# EAGLE design Beepoo (EAGLE 6.5.0)
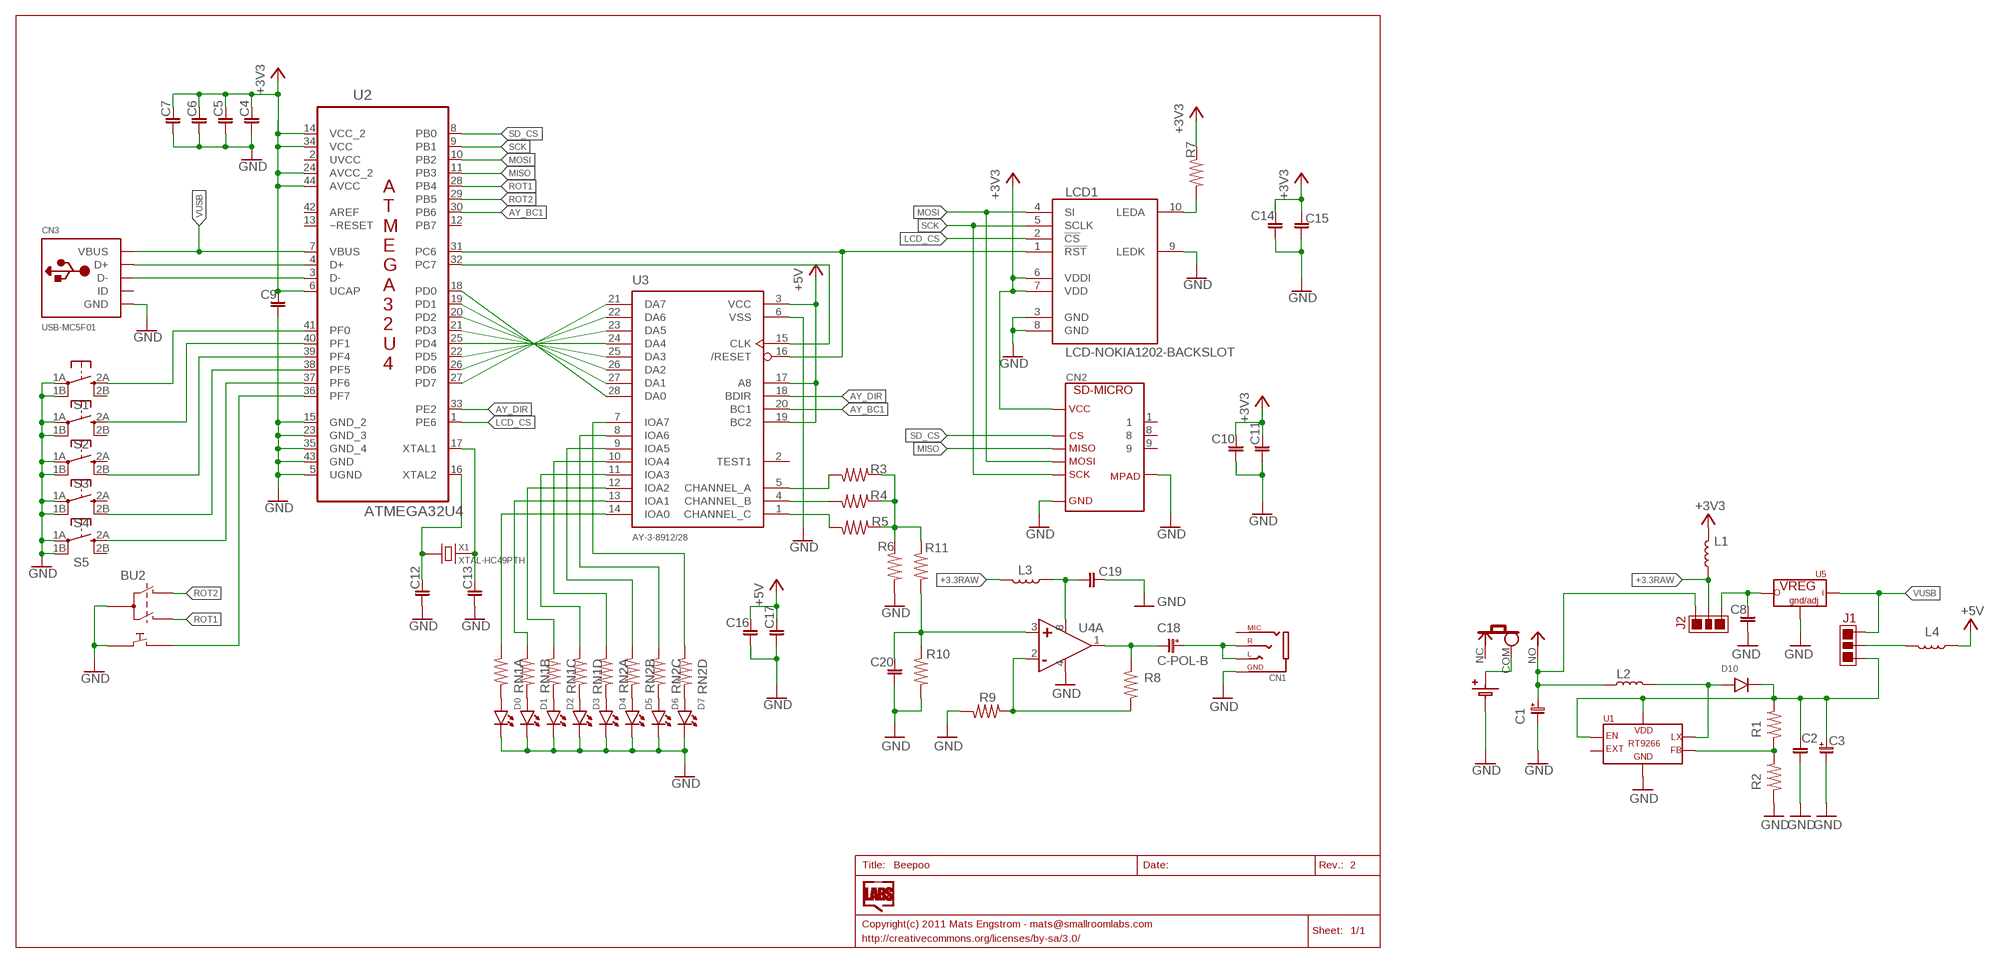
[diagram p0: schematic, sheet 1]

## Parts
BA1  BATTERY2-CR123  [BAT-CR123A]
BU2  ROTARY  [ROTARY]
C1  C-POL-C  [PANASONIC_C]
C2  C-0805  [C0805]
C3  EEEFK0J101UR  C-POL-C  [PANASONIC_C]
C4  C-0805  [C0805]
C5  C-0805  [C0805]
C6  C-0805  [C0805]
C7  C-0805  [C0805]
C8  1u  C-0805  [C0805]
C9  1u  C-0805  [C0805]
C10  1u  C-0805  [C0805]
C11  C-0805  [C0805]
C12  C-0805  [C0805]
C13  C-0805  [C0805]
C14  1u  C-0805  [C0805]
C15  C-0805  [C0805]
C16  1u  C-0805  [C0805]
C17  C-0805  [C0805]
C18  C-POL-B  [PANASONIC_B]
C19  1u  C-0805  [C0805]
C20  C-0805  [C0805]
CN1  JACK4PTH  [PJ320E]
CN2  SD-MICRO  [SD-TFP09]
CN3  USB-MC5F01  [USB-MICRO-MC5F01]
D0  LED-0805  [LED0805]
D1  LED-0805  [LED0805]
D2  LED-0805  [LED0805]
D3  LED-0805  [LED0805]
D4  LED-0805  [LED0805]
D5  LED-0805  [LED0805]
D6  LED-0805  [LED0805]
D7  LED-0805  [LED0805]
D10  DIODE-SOD123  [SOD123]
J1  JUMPER3-1.5MM  [JP3-1.5MM]
J2  JUMPER3-1.5MM  [JP3-1.5MM]
L1  L-0805  [L0805]
L2  L-BOURNS-SRP7030  [IND-BOURNS-SRP7030]
L3  L-0805  [L0805]
L4  L-0805  [L0805]
LCD1  LCD-NOKIA1202-BACKSLOT  [NOKIA1202LCD-BACK-SLOT]
R1  R-0805  [R0805]
R2  R-0805  [R0805]
R3  R-0805  [R0805]
R4  R-0805  [R0805]
R5  R-0805  [R0805]
R6  R-0805  [R0805]
R7  R-0805  [R0805]
R8  R-0805  [R0805]
R9  R-0805  [R0805]
R10  R-0805  [R0805]
R11  R-0805  [R0805]
RN1  R-ARR4  [RN8P-4R-CRA06S]
RN2  R-ARR4  [RN8P-4R-CRA06S]
S1  SWITCH2-12X12PTH  [TACT12X12-PTH]
S2  SWITCH2-12X12PTH  [TACT12X12-PTH]
S3  SWITCH2-12X12PTH  [TACT12X12-PTH]
S4  SWITCH2-12X12PTH  [TACT12X12-PTH]
S5  SWITCH2-12X12PTH  [TACT12X12-PTH]
SW2  SLIDE1-PCM12  [SW-PCM12]
U1  RT9266-SOT23  [SOT23-6]
U2  ATMEGA32U4  [TQFP44]
U3  AY-3-8912/28  [DIL28-6]
U4  OPAMP-DUAL-SOIC8  [SO08]
U5  VREG3-SOT223  [SOT223]
X1  XTAL-HC49PTH  [HC49US]

## Nets
+3.3RAW: J2.P$2 L1.1 L3.2
+3V3: C4.2 C5.2 C6.2 C7.2 C9.2 C10.2 C11.2 C14.2 C15.2 CN2.4 L1.2 LCD1.6(VDDI) LCD1.7(VDD) R7.1 U2.6(UCAP) U2.14(VCC_2) U2.24(AVCC_2) U2.34(VCC) U2.44(AVCC)
+5V: C16.2 C17.2 L4.1 U3.3(VCC) U3.17(A8) U3.19(BC2)
AY_BC1: U2.30(PB6) U3.20(BC1)
AY_CLK: U2.32(PC7) U3.15(CLK)
AY_DIR: U2.33(PE2) U3.18(BDIR)
AY_RESET: LCD1.1(!RST) U2.31(PC6) U3.16(/RESET)
BAT: BA1.POS(POS1) SW2.COM
BAT-SWITCHED: C1.+(A) J2.P$1 L2.P$1 SW2.NO
GND: BA1.NEG BU2.Q BU2.SW1 C1.-(C) C2.2 C3.-(C) C4.1 C5.1 C6.1 C7.1 C8.1 C9.1 C10.1 C11.1 C12.1 C13.1 C14.1 C15.1 C16.1 C17.1 C19.2 C20.1 CN1.G(GND) CN2.GND@1 CN2.GND@2 CN3.P5(GND) D0.C D1.C D2.C D3.C D4.C D5.C D6.C D7.C LCD1.3(GND) LCD1.8(GND) LCD1.9(LEDK) R2.1 R6.2 R9.2 R10.2 S1.1A S1.1B S2.1A S2.1B S3.1A S3.1B S4.1A S4.1B S5.1A S5.1B U1.3(GND) U2.5(UGND) U2.15(GND_2) U2.23(GND_3) U2.35(GND_4) U2.43(GND) U3.6(VSS) U4.4(A:V-) U5.1(G/A)
LCD_CS: LCD1.2(!CS) U2.1(PE6)
MISO: CN2.7 U2.11(PB3)
MOSI: CN2.3 LCD1.4(SI) U2.10(PB2)
N$1: D10.A L2.P$2 U1.4(LX)
N$2: C18.+(A) CN1.L CN1.R
N$3: R1.1 R2.2 U1.6(FB)
N$4: U2.27(PD7) U3.21(DA7)
N$5: U2.26(PD6) U3.22(DA6)
N$6: U2.22(PD5) U3.23(DA5)
N$7: U2.25(PD4) U3.24(DA4)
N$8: U2.21(PD3) U3.25(DA3)
N$9: U2.20(PD2) U3.26(DA2)
N$10: U2.19(PD1) U3.27(DA1)
N$11: U2.18(PD0) U3.28(DA0)
N$12: C8.2 J2.P$3 U5.2(OUT) U5.4(OUT)
N$13: CN3.P3(D+) U2.4(D+)
N$14: CN3.P2(D-) U2.3(D-)
N$15: C2.1 C3.+(A) D10.C J1.P$3 R1.2 U1.1(EN) U1.5(VDD)
N$16: D0.A RN1.8
N$17: D1.A RN1.7
N$18: D2.A RN1.6
N$19: D3.A RN1.5
N$20: D4.A RN2.8
N$21: C12.2 U2.16(XTAL2) X1.1
N$22: D5.A RN2.7
N$23: D7.A RN2.5
N$24: D6.A RN2.6
N$25: RN2.4 U3.7(IOA7)
N$26: RN2.3 U3.8(IOA6)
N$27: RN2.2 U3.9(IOA5)
N$28: RN2.1 U3.10(IOA4)
N$29: RN1.4 U3.11(IOA3)
N$30: RN1.3 U3.12(IOA2)
N$31: RN1.2 U3.13(IOA1)
N$32: RN1.1 U3.14(IOA0)
N$33: R3.2 U3.5(CHANNEL_A)
N$34: R4.2 U3.4(CHANNEL_B)
N$35: R5.2 U3.1(CHANNEL_C)
N$36: S1.2A U2.41(PF0)
N$37: S2.2A U2.40(PF1)
N$38: S3.2B U2.39(PF4)
N$39: S4.2B U2.38(PF5)
N$40: S5.2A U2.37(PF6)
N$41: R3.1 R4.1 R5.1 R6.1 R11.1
N$42: BU2.SW2 U2.36(PF7)
N$43: C13.2 U2.17(XTAL1) X1.2
N$44: LCD1.10(LEDA) R7.2
N$45: C18.-(C) R8.1 U4.1(A:OUT)
N$46: C19.1 L3.1 U4.8(A:V+)
N$47: R8.2 R9.1 U4.2(A:NEG)
N$48: J1.P$2 L4.2
N$49: C20.2 R10.1 R11.2 U4.3(A:POS)
ROT1: BU2.Q2 U2.28(PB4)
ROT2: BU2.Q1 U2.29(PB5)
SCK: CN2.5 LCD1.5(SCLK) U2.9(PB1)
SD_CS: CN2.2 U2.8(PB0)
VUSB: CN3.P1(VBUS) J1.P$1 U2.7(VBUS) U5.3(IN)
Unconnected: CN1.MIC CN2.1 CN2.8 CN2.9 CN3.P4(ID) S1.2B S2.2B S3.2A S4.2A S5.2B SW2.NC U1.2(EXT) U2.12(PB7) U2.13(~RESET) U2.42(AREF) U3.2(TEST1) U4.5(B:POS) U4.6(B:NEG) U4.7(B:OUT)

## Power pins joined to a net without a drawn wire
UVCC: U2.2(UVCC)

## Library data of the parts
BA1 = SRL:BATTERY2
BU2 = SRL:ROTARY
C1 C3 C18 = SRL:C-POL
C2 C4-C17 C19 C20 = SRL:C: Not verified
CN1 = SRL:JACK4
CN2 = SRL:SD
CN3 = SRL:USB
D0 D1-D7 = SRL:LED
D10 = SRL:DIODE
J1 J2 = SRL:JUMPER3
L1-L4 = SRL:L: Not verified
LCD1 = SRL:LCD-NOKIA1202
R1-R11 = SRL:R: Not Verified
RN1 RN2 = SRL:R-ARR4: 4 Resistor Array 0603
S1-S5 = SRL:SWITCH2
SW2 = SRL:SLIDE1
U1 = SRL:RT9266
U2 = SRL:ATMEGA32U4: 8-bit Microcontroller with ISP Flash and USB Controller
U3 = SRL:AY-3-8912/28
U4 = SRL:OPAMP-DUAL
U5 = SRL:VREG3
X1 = SRL:XTAL

## Board
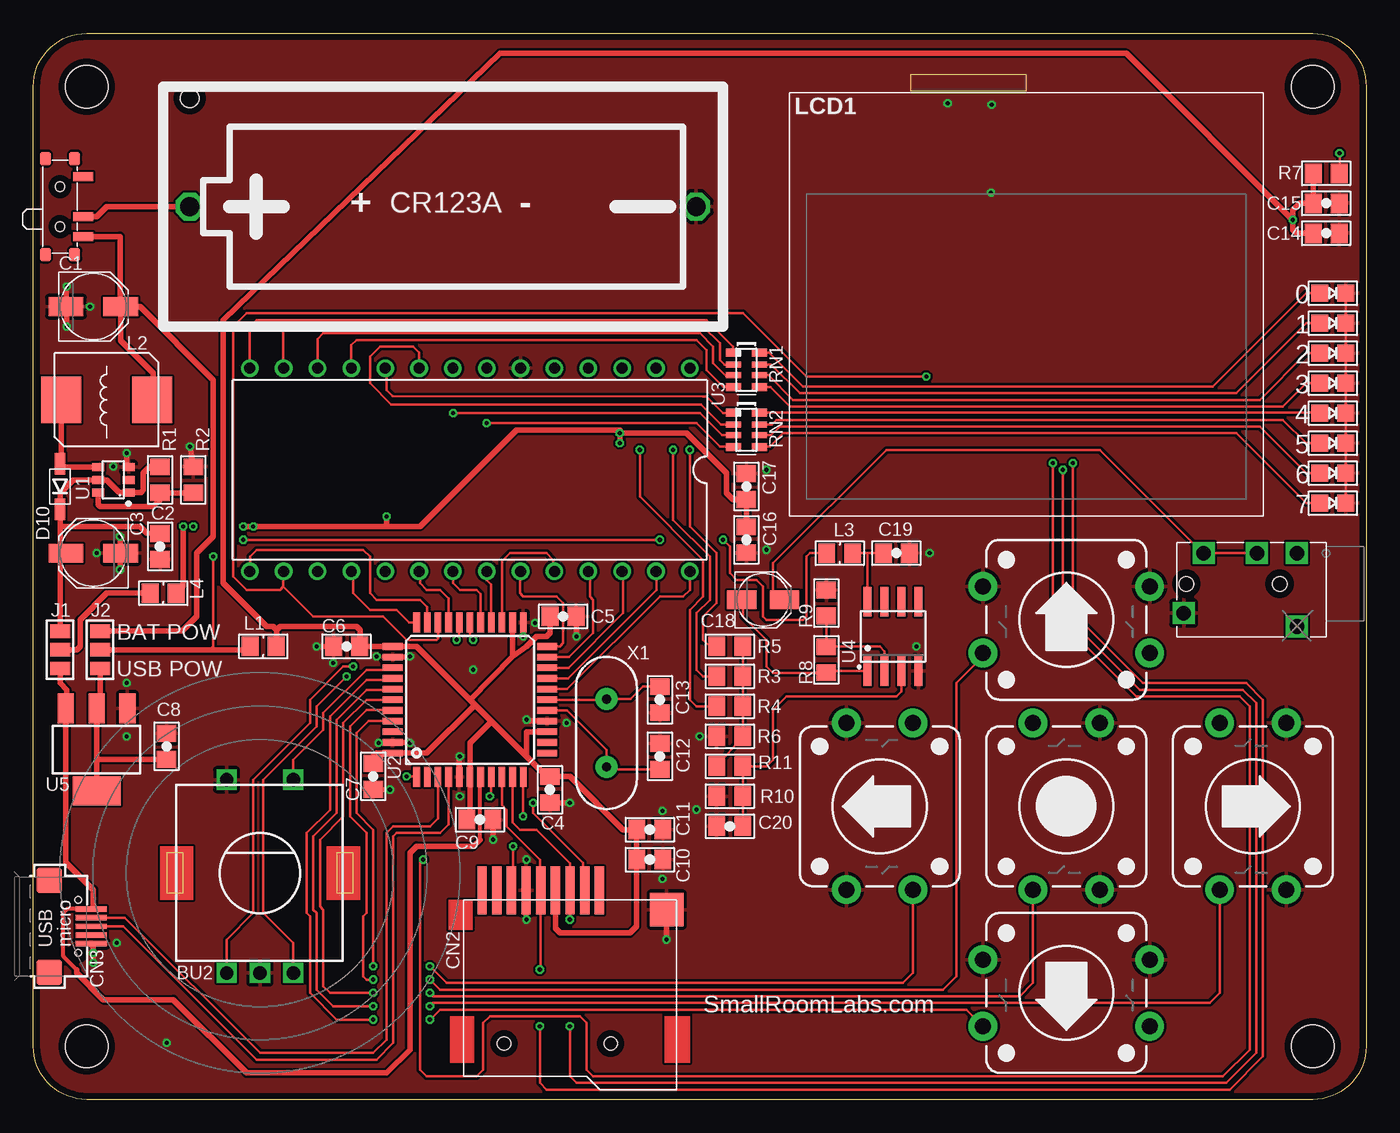
[diagram p1: board, top side]
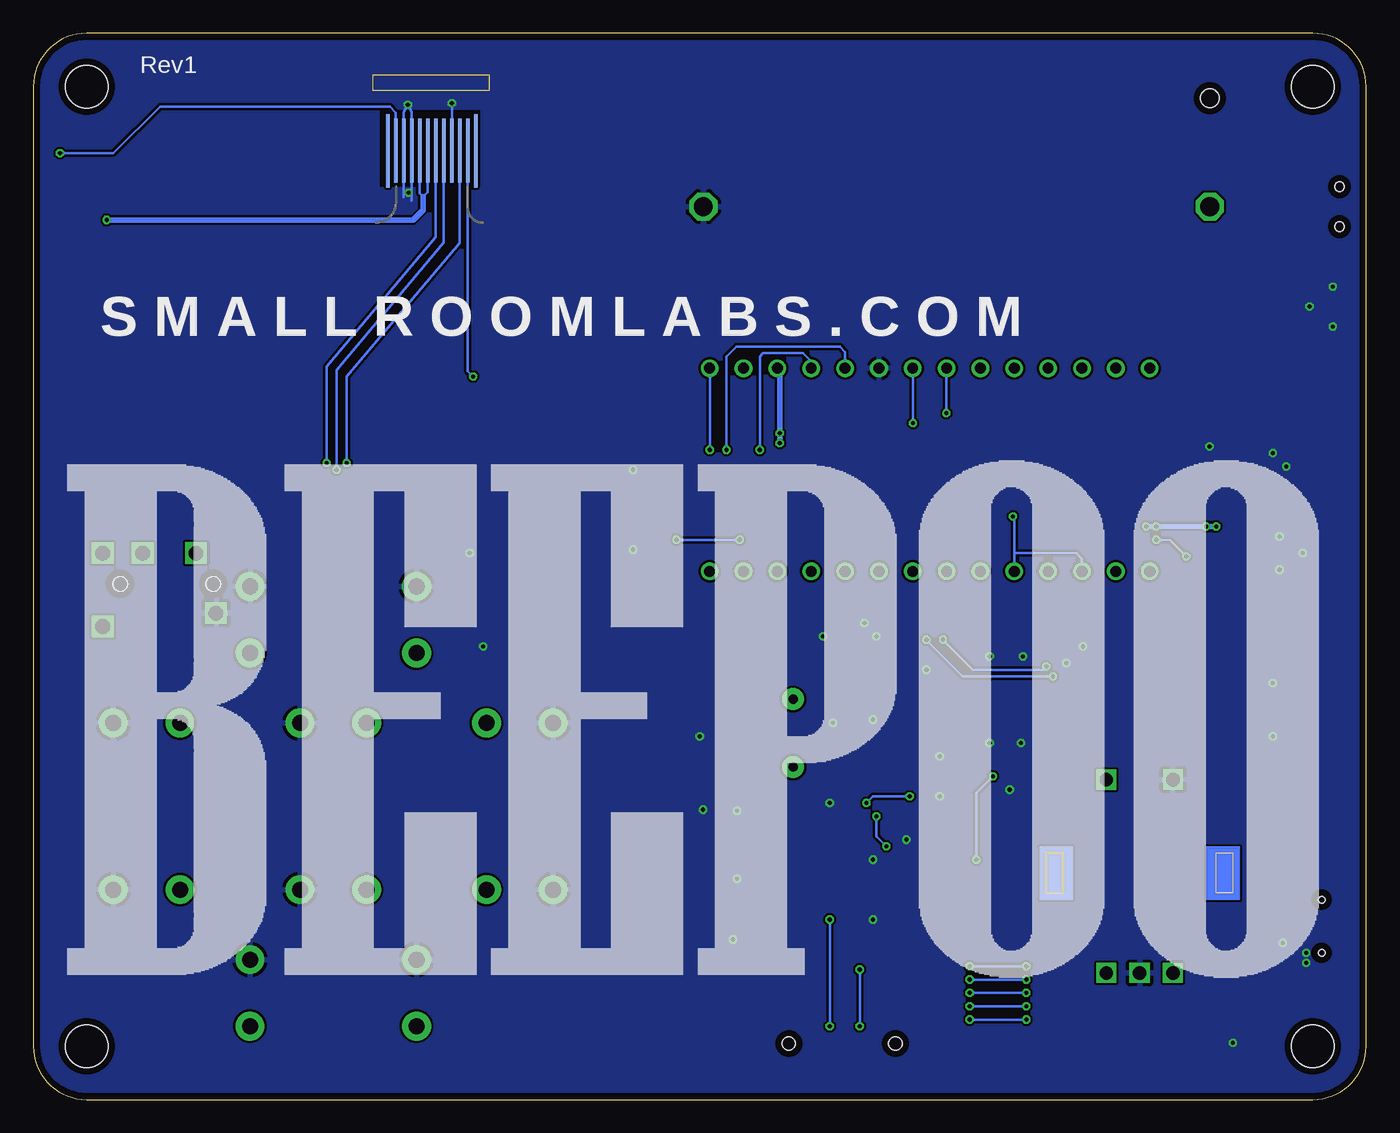
[diagram p2: board, bottom side, seen from below]

Size 100 x 80 mm. Coordinates in mm from the lower left corner, seen from the top.
Outline: 0,76 arc-90 4,80 96,80 arc-90 100,76 100,4 arc-90 96,0 4,0 arc-90 0,4 0,76
Copper layers (1*16): Top 0.035mm / dielectric 1.5mm / Bottom 0.035mm
Design rules "SmartPrototyping": minimum track width 7mil, minimum drill 12mil, track to track 7mil, track to pad 7mil, pad to pad 7mil, via to via 7mil, smd to smd 0mil, copper to edge 20mil, drill to drill 10mil, minimum pad ring 10mil, minimum via ring 6mil, stop-mask expansion 2mil, vias tented up to drill 25mil, thermal gap 10mil
Holes 3.2 mm at 4,76 96,76 96,4 4,4
tRestrict: area 4.5,32.2 to 5,32.5; area 53,48.5 to 54,56.5
bRestrict: area 66.5,68.5 to 74,74.2

### Footprints (pad centres in the part's own frame; a part is rotated, then mirrored left to right if it is on the bottom)
BAT-CR123A = drill 1.4 octagon: NEG 17.73,0; POS -20.27,0 | hole 1.4: -20.27,8.128
ROTARY = drill 1 square: Q 0,-7.5; Q1 -2.5,-7.5; Q2 2.5,-7.5; SW1 -2.5,7; SW2 2.5,7
PANASONIC_C = smd 2.6 x 1.4: + 2.05,0; - -2.05,0
C0805 = smd 1.27 x 1.473: 1 -0.975,0; 2 0.975,0
PANASONIC_B = smd 2.2 x 1.4: + 1.6,0; - -1.6,0
PJ320E = drill 1.1 square: DUMMY 2.2,5.5; G 10.7,4.5; L 9.2,0; MIC 2.2,0; R 5.2,0 | hole 1.1: 3.5,2.3; 10.5,2.3
SD-TFP09 = smd 0.7 x 3.6: 1 3.47,0.2; 2 2.37,0.2; 3 1.27,0.2; 4 0.17,0.2; 5 -0.93,0.2; 7 -3.13,0.2; 8 -4.23,0.2; 9 -5.33,0.2; GND@1 -2.03,0.2 | smd 2.5 x 2.5: GND@2 8.52,-1.25 | hole 1: -3.68,-11.3; 4.32,-11.3
USB-MICRO-MC5F01 = smd 0.4 x 2.35: P1 -1.3,4.6; P2 -0.65,4.6; P3 0,4.6; P4 0.65,4.6; P5 1.3,4.6 | smd 1.9 x 1.9: P$1 -3.45,1.45; P$2 3.45,1.45 | hole 0.5: -2,3.6; 2,3.6
LED0805 = smd 1.27 x 1.27: A -0.975,0; C 0.975,0
SOD123 = smd 1.6 x 0.8: A 1.7,0; C -1.7,0
JP3-1.5MM = smd 1 x 1.5: P$1 -1.4,0; P$2 0,0; P$3 1.4,0
L0805 = smd 1.27 x 1.473: 1 -0.975,0; 2 0.975,0
IND-BOURNS-SRP7030 = smd 3 x 3.5: P$1 -3.4,0; P$2 3.4,0
NOKIA1202LCD-BACK-SLOT = smd 0.25 x 5.5 bottom: 0 -7.69,14.678; 11 -1.09,14.678 | smd 0.25 x 4.8 bottom: 1 -7.09,14.678; 2 -6.49,14.678; 3 -5.89,14.678; 4 -5.29,14.678; 5 -4.69,14.678; 6 -4.09,14.678; 7 -3.49,14.678; 8 -2.89,14.678; 9 -2.29,14.678; 10 -1.69,14.678
R0805 = smd 1.27 x 1.473: 1 -0.975,0; 2 0.975,0
RN8P-4R-CRA06S = smd 0.63 x 1.15: 1 -1.295,-0.975; 4 1.295,-0.975; 5 1.295,0.975; 8 -1.295,0.975 | smd 0.44 x 1.15: 2 -0.4,-0.975; 3 0.4,-0.975; 6 0.4,0.975; 7 -0.4,0.975
TACT12X12-PTH = drill 1.2 pad 2.159: 1A -6.25,2.5; 1B 6.25,2.5; 2A -6.25,-2.5; 2B 6.25,-2.5
SW-PCM12 = smd 0.7 x 1.5: COM 0.75,1.75; NC -2.25,1.75; NO 2.25,1.75 | smd 1 x 0.8: P$1 -3.6,-1.1; P$2 -3.6,1.1; P$3 3.6,1.1; P$4 3.6,-1.1 | hole 0.7: -1.5,0; 1.5,0
SOT23-6 = smd 0.6 x 0.9: 1 -0.95,-1.15; 2 0,-1.15; 3 0.95,-1.15; 4 0.95,1.15; 5 0,1.15; 6 -0.95,1.15
TQFP44 = smd 1.5 x 0.5: 1 -5.8,4; 2 -5.8,3.2; 3 -5.8,2.4; 4 -5.8,1.6; 5 -5.8,0.8; 6 -5.8,0; 7 -5.8,-0.8; 8 -5.8,-1.6; 9 -5.8,-2.4; 10 -5.8,-3.2; 11 -5.8,-4; 23 5.8,-4; 24 5.8,-3.2; 25 5.8,-2.4; 26 5.8,-1.6; 27 5.8,-0.8; 28 5.8,0; 29 5.8,0.8; 30 5.8,1.6; 31 5.8,2.4; 32 5.8,3.2; 33 5.8,4 | smd 0.5 x 1.5: 12 -4,-5.8; 13 -3.2,-5.8; 14 -2.4,-5.8; 15 -1.6,-5.8; 16 -0.8,-5.8; 17 0,-5.8; 18 0.8,-5.8; 19 1.6,-5.8; 20 2.4,-5.8; 21 3.2,-5.8; 22 4,-5.8; 34 4,5.8; 35 3.2,5.8; 36 2.4,5.8; 37 1.6,5.8; 38 0.8,5.8; 39 0,5.8; 40 -0.8,5.8; 41 -1.6,5.8; 42 -2.4,5.8; 43 -3.2,5.8; 44 -4,5.8
DIL28-6 = drill 0.813: 1 -16.51,-7.62; 2 -13.97,-7.62; 3 -11.43,-7.62; 4 -8.89,-7.62; 5 -6.35,-7.62; 6 -3.81,-7.62; 7 -1.27,-7.62; 8 1.27,-7.62; 9 3.81,-7.62; 10 6.35,-7.62; 11 8.89,-7.62; 12 11.43,-7.62; 13 13.97,-7.62; 14 16.51,-7.62; 15 16.51,7.62; 16 13.97,7.62; 17 11.43,7.62; 18 8.89,7.62; 19 6.35,7.62; 20 3.81,7.62; 21 1.27,7.62; 22 -1.27,7.62; 23 -3.81,7.62; 24 -6.35,7.62; 25 -8.89,7.62; 26 -11.43,7.62; 27 -13.97,7.62; 28 -16.51,7.62
SO08 = smd 0.6 x 2.2: 1 -1.905,-2.6; 2 -0.635,-2.6; 3 0.635,-2.6; 4 1.905,-2.6; 5 1.905,2.6; 6 0.635,2.6; 7 -0.635,2.6; 8 -1.905,2.6
SOT223 = smd 1.219 x 2.235: 1 -2.311,-3.099; 2 0,-3.099; 3 2.311,-3.099 | smd 3.6 x 2.2: 4 0,3.099
HC49US = drill 0.7 pad 1.651: 1 -2.54,0; 2 2.54,0

### Placement (x,y rotation side)
BA1  32,67 0 top
BU2  17,17 0 top
C1  4.5,59.5 0 top
C2  9.5,41.5 270 top
C3  4.5,41 180 top
C4  38.75,23.25 90 top
C5  39.75,36.25 180 top
C6  23.5,34 0 top
C7  25.5,24.25 90 top
C8  10,26.5 270 top
C9  33.5,21 180 top
C10  46.25,18 180 top
C11  46.25,20.25 180 top
C12  47,25.75 270 top
C13  47,30 90 top
C14  97,65 180 top
C15  97,67.25 180 top
C16  53.5,42 90 top
C17  53.5,46 270 top
C18  54.75,37.5 0 top
C19  64.75,41 0 top
C20  52.25,20.5 0 top
CN1  97,41 180 top
CN2  39,15.5 0 top
CN3  -0.25,13 270 top
D0  97.5,60.5 0 top
D1  97.5,58.25 0 top
D2  97.5,56 0 top
D3  97.5,53.75 0 top
D4  97.5,51.5 0 top
D5  97.5,49.25 0 top
D6  97.5,47 0 top
D7  97.5,44.75 0 top
D10  2,46 90 top
J1  2,33.75 90 top
J2  5,33.75 270 top
L1  17.25,34 0 top
L2  5.5,52.5 180 top
L3  60.5,41 180 top
L4  9.75,38 180 top
LCD1  74.5,56.5 0 top
R1  9.5,46.5 90 top
R2  12,46.5 270 top
R3  52.25,31.75 180 top
R4  52.25,29.5 180 top
R5  52.25,34 180 top
R6  52.25,27.25 180 top
R7  97,69.5 0 top
R8  59.5,33 90 top
R9  59.5,37.25 90 top
R10  52.25,22.75 180 top
R11  52.25,25 0 top
RN1  53.5,54.75 270 top
RN2  53.5,50.25 270 top
S1  63.5,22 90 top
S2  77.5,36 0 top
S3  77.5,22 270 top
S4  91.5,22 270 top
S5  77.5,8 0 top
SW2  2,67 270 top
U1  6,46.5 90 top
U2  32.75,30 90 top
U3  32.75,47.25 180 top
U4  64.5,34.75 0 top
U5  4.75,26.25 180 top
X1  43,27.5 90 top

### Tracks (layer width: path | path; a pad name or v marks a point on that pad's centre or on a via)
+3.3RAW  (via drill 0.3)
  Top 0.203: L3.2 58.25,41 58,40.75 58,36.25 57.75,36 55,36 54.75,36.25 54.75,38.5 54.25,39 52.75,39 52.25,39.5 52.25,41.5 v51.75,42 | v47,42 v15.75,42 | v13.5,40.75 13.5,34 13.25,33.75
  Top 0.406: J2.P$2 13.25,33.75 16.02,33.75 L1.1
  Bottom 0.203: v51.75,42 v47,42 | v15.75,42 14.75,42 v13.5,40.75
+3V3  (via drill 0.3)
  Top 0.178: 45.3,20.4 C11.2
  Top 0.406: U2.14 37,27.6 37,25.75 | 35.95,33.25 U2.24 | C5.2 38.77,35.02 38.5,34.75 37.75,34.75 37,34 35.95,33.25 | 37,25.75 38.52,24.23 C4.2 40.27,24.23 44.25,20.25 C11.2 C10.2 45.25,17.98 45.25,13 44.75,12.5 39.5,12.5 39.17,12.83 CN2.4 | 32.75,30 28.75,34 U2.34 C6.2 24.5,34.02 24.5,35.25 24.25,35.5 18.5,35.5 18.25,35.25 | 32.75,30 33.12,29.62 | 33.12,29.62 34.38,28.38 | 34.38,28.38 37,25.75 | 35.95,33.25 32.75,30 | 33.12,29.62 29.5,26 U2.44 25.75,26 25.5,25.75 C7.2 | v94.5,66 82,78.5 35,78.5 14.25,58.5 14.25,38.75 17.5,35.5 18,35.5 18.25,35.25 | C14.2 94.75,65 94.5,65.25 v94.5,66 | v94.5,66 94.5,66.75 95,67.25 C15.2 R7.1 | C9.2 32.75,21.73 U2.6 32.75,26.75 34.38,28.38 | 18.25,35.25 18.25,34.02 L1.2
  Bottom 0.203: LCD1.7 71.01,68.01 70.75,67.75 70.41,68.09 LCD1.6
  Bottom 0.406: v94.5,66 71.5,66 70.75,66.75 70.75,67.75
+5V  (via drill 0.3)
  Top 0.406: v44,50 v44,49.25 | v44,50 44,50.25 36.25,50.25 29,43 26.5,43 | 26.5,43 v16.5,43 v15.75,43 | C16.2 C17.2 52.48,45.02 52,45.5 52,47 49,50 v44,50 | v26.5,43.75 26.5,43 | v11.25,43 11.25,38.52 L4.1
  Bottom 0.203: U3.19 26.4,41 | 26.4,41 26.4,43.65 v26.5,43.75 | U3.17 21.32,40.57 21.75,41 26.4,41
  Bottom 0.406: v44,49.25 44,54.69 U3.3 | v16.5,43 v12,43 v11.25,43
AY_BC1
  Top 0.203: U2.30 31.15,37.6 30.5,38.25 29.5,38.25 29,38.75 29,39.57 U3.20
AY_CLK
  Top 0.203: U2.32 29.55,36.95 29,37.5 25.75,37.5 25.25,38 25.25,40.75 24.75,41.25 16.75,41.25 16.25,40.75 U3.15
AY_DIR
  Top 0.203: U2.33 28.2,35.8 27.25,36.75 25.25,36.75 24,38 24,39.49 U3.18
AY_RESET  (via drill 0.3)
  Top 0.203: U2.31 30.35,34.6 30.25,34.5 28,34.5 26.25,36.25 21,36.25 18.75,38.5 | 18.75,38.5 18.75,39.6 U3.16 | v67,54.25 58,54.25 53.25,59 16,59 15,58 15,39.25 16,38.25 18.5,38.25 18.75,38.5
  Bottom 0.203: LCD1.1 67.41,54.66 v67,54.25
BAT
  Top 0.406: SW2.COM 4.75,66.25 5.5,67 BA1.POS
BAT-SWITCHED
  Top 0.406: C1.+ 6.5,59.55 6.5,64.75 SW2.NO | C1.+ 6.55,56.95 9,54.5 9,52.6 L2.P$1 | C1.+ 8,59.5 13.5,54 13.5,42.25 12.25,41 12.25,36.25 11.15,35.15 J2.P$1
GND  (via drill 0.3)
  Top 0.203: D7.C D6.C D5.C D4.C D3.C D2.C D1.C D0.C 98.75,60.52
  Top 0.406: 7.15,47.35 U1.3 7,47.6 v7,48.5 | R2.1 v11.75,49 | v2.5,61 2.45,60.95 C1.- 2.5,59.5 v2.5,58 | v6.5,39.75 6.5,40.75 | 6.5,40.75 v6.5,42.25 | C3.- 6.5,40.75 | CN3.P5 4.3,11.7 4.5,11.5 v4.5,10.25 | U2.5 31.95,25.7 v32,25.75 | U2.43 28.2,26.8 v28.25,26.75 | U2.35 28.2,33.2 v28.25,33.25 | U2.23 v36.75,34.75 | U2.15 37.1,28.4 v37,28.5 | CN2.GND@2 47.52,12.75 v47.5,12 | v37,13.5 36.97,13.75 CN2.GND@1 37.02,15.76 | C4.1 v40.25,22.25 | C5.1 v40.75,34.75 | C6.1 v21.25,34 | C7.1 v26.75,23.25 | C9.1 v34.5,19.5
  Bottom 0.203: v68.6,74.75 68.6,73.92 LCD1.3 | 71.61,67.44 LCD1.8 71.61,74.11 v71.9,74.65 72.21,74.09 LCD1.9 72.21,67.71
  other vias: 4.5,11 50,27.25 37,18 25.75,33.25 25.9,26.75 32,22.75 40,28.25 37.65,35.75 6,47.5 4.75,41 4.25,59.5 22.5,32.75 33,32.25 55,47.25 55,41.25 47.2,16.55 47.2,21.65 71.85,68.05 49.75,21.75 6.25,11.75 7,27.25 7,31.25 10,4.25 66.25,34 67.25,41
  pour Bottom: 0,80 100.5,80 100.5,0 0,0
  pour Top: -0.25,80 100,80 100,0 -0.25,0
LCD_CS  (via drill 0.3)
  Top 0.203: v76.5,47.75 76.5,36.5 82.75,30.25 90.5,30.25 91.25,29.5 91.25,3.75 89.25,1.75 42,1.75 41.5,2.25 41.5,5.75 41,6.25 34.25,6.25 33.75,5.75 33.75,2.25 33.25,1.75 29.5,1.75 29,2.25 29,17.75 v29.25,18 | v28,24.25 28.7,24.25 U2.1
  Bottom 0.203: LCD1.2 68.01,64.24 76.5,54.25 v76.5,47.75 | v29.25,18 29.25,23 v28,24.25
MISO  (via drill 0.3)
  Top 0.203: 35.75,15.82 CN2.7 36,15.83 v36,19 | U2.11 v36.75,21.25
  Bottom 0.203: v36.75,21.25 36.75,19.75 v36,19
MOSI  (via drill 0.3)
  Top 0.203: U2.10 35.95,20.8 36.5,20.25 37.75,20.25 40.27,17.73 CN2.3 | 40.25,15.72 CN2.3 | v77.25,47.25 77.25,36.5 83,30.75 90.75,30.75 91.75,29.75 91.75,3.5 89.5,1.25 40.75,1.25 40.25,1.75 v40.25,5.5 | CN2.3 40.27,13.52 v40.25,13.5
  Bottom 0.203: LCD1.4 69.21,64.29 77.25,54.75 v77.25,47.25 | v40.25,13.5 v40.25,5.5
N$1
  Top 0.406: U1.4 2.25,47.45 D10.A 2.1,47.8 L2.P$2
N$2
  Top 0.203: CN1.R CN1.L 87.75,41 80,48.75 64,48.75 55.5,40.25 55.5,37.85 C18.+
N$3
  Top 0.406: U1.6 4.85,44.65 5,44.5 9,44.5 9.5,45 R1.1 R2.2
N$4
  Top 0.203: U2.27 33.55,37.95 33.25,38.25 32,38.25 31.5,38.75 31.5,39.61 U3.21
N$5
  Top 0.203: U2.26 34.35,38.65 34,39 34,39.61 U3.22
N$6
  Top 0.203: U2.22 39.5,34 39.75,34.25 39.75,37.25 39.25,37.75 36.75,37.75 36.5,38 36.5,39.57 U3.23
N$7
  Top 0.203: U2.25 35.15,40.4 35.75,41 38.5,41 39,40.5 39,39.73 U3.24
N$8
  Top 0.203: U2.21 40.2,33.2 42,35 42,37.5 41.75,37.75 41.75,39.52 U3.25
N$9
  Top 0.203: U2.20 40.15,32.4 44.25,36.5 44.25,39.56 U3.26
N$10
  Top 0.203: U2.19 40.1,31.6 46.75,38.25 46.75,39.6 U3.27
N$11
  Top 0.203: U2.18 40.05,30.8 47,37.75 48.75,37.75 49.25,38.25 U3.28
N$12
  Top 0.406: U5.4 4.75,25.5 | 4.75,25.5 U5.2 5,29.6 J2.P$3 | C8.2 4.78,25.52 4.75,25.5
N$13
  Top 0.203: U2.4 31.15,20.65 30.5,20 27.25,20 27,19.75 27,4.25 25.75,3 16.75,3 6.75,13 CN3.P3
N$14
  Top 0.203: U2.3 30.35,21.1 29.75,20.5 27,20.5 26.5,20 26.5,4.5 25.5,3.5 17,3.5 6.85,13.65 CN3.P2
N$15
  Top 0.406: 2,43 D10.C 2,45.5 3,46.5 U1.5 5.5,46.5 6.45,45.55 U1.1 8.09,45.55 8.26,45.72 8.26,46.99 8.74,47.48 R1.2 | 2,43 2,40.95 C3.+ 2,40.55 J1.P$3 | C2.1 8.5,42.5 8,43 2,43
N$16
  Top 0.203: RN1.8 55.2,56.05 57.75,53.5 88.5,53.5 95.5,60.5 D0.A
N$17
  Top 0.203: RN1.7 55.35,55.15 57.5,53 90.25,53 95.5,58.25 D1.A
N$18
  Top 0.203: D2.A 95.5,56 92,52.5 57,52.5 55.15,54.35 RN1.6
N$19
  Top 0.203: RN1.5 55.3,53.45 56.75,52 93.75,52 95.5,53.75 D3.A
N$20
  Top 0.203: RN2.8 96.48,51.55 D4.A
N$21
  Top 0.203: U2.16 40.05,29.2 43,26.25 X1.1 43,24.77 C12.2
N$22
  Top 0.203: D5.A 95.5,49.25 93.75,51 55.75,51 55.4,50.65 RN2.7
N$23
  Top 0.203: D7.A 95.5,44.75 90.25,50 56.25,50 55.25,49 54.52,49 RN2.5
N$24
  Top 0.203: D6.A 95.5,47 92,50.5 56,50.5 55.35,49.85 RN2.6
N$25  (via drill 0.3)
  Top 0.203: v34,50.75 49.75,50.75 51.5,49 52.48,49 RN2.4
  Bottom 0.203: v34,50.75 34,54.6 U3.7
N$26  (via drill 0.3)
  Top 0.203: v31.5,51.5 50,51.5 51.65,49.85 RN2.3
  Bottom 0.203: v31.5,51.5 31.5,54.85 U3.8
N$27
  Top 0.203: U3.9 28.94,56.06 28.5,56.5 26,56.5 25.25,55.75 25.25,53.75 26.85,52.15 50.1,52.15 51.6,50.65 RN2.2
N$28
  Top 0.203: U3.10 26.5,54.77 26.5,53.25 26.95,52.8 50.25,52.75 50.5,52.75 51.75,51.5 52.48,51.5 RN2.1
N$29
  Top 0.203: U3.11 23.86,56.61 24.25,57 49.75,57 50.5,56.25 50.5,54.75 51.75,53.5 52.48,53.5 RN1.4
N$30
  Top 0.203: U3.12 21.32,57.07 21.75,57.5 50,57.5 51,56.5 51,55.25 52,54.25 52.42,54.25 RN1.3
N$31
  Top 0.203: RN1.2 51.85,55.15 51.5,55.5 51.5,56.75 50.25,58 19.25,58 18.75,57.75 18.75,54.9 U3.13
N$32
  Top 0.203: U3.14 16.24,57.99 16.75,58.5 50.5,58.5 52.5,56.5 52.5,56.07 RN1.1
N$33  (via drill 0.3)
  Top 0.203: v48,48.75 48,43.5 50.75,40.75 50.75,37.5 49.75,36.5 49.75,32.25 50.25,31.75 R3.2
  Bottom 0.203: U3.5 39.1,56.1 39.5,56.5 47.25,56.5 48,55.75 v48,48.75
N$34  (via drill 0.3)
  Top 0.203: v45.5,48.75 45.5,45.25 50.25,40.5 50.25,37.75 49.25,36.75 49.25,30 49.75,29.5 R4.2
  Bottom 0.203: U3.4 41.64,55.39 42.25,56 45.25,56 45.5,55.75 v45.5,48.75
N$35  (via drill 0.3)
  Top 0.203: R5.2 50.75,34 50.25,34.5 50.25,36.25 51.25,37.25 51.25,41 49.26,42.99 v49.26,48.74 v49.25,48.75
  Bottom 0.203: v49.25,48.75 U3.1
N$36  (via drill 0.3)
  Top 0.203: U2.41 25.15,28.4 24.25,27.5 24.25,21.5 25.5,20.25 v25.5,10 | v29.75,10 31,8.75 65.25,8.75 66,9.5 S1.2A
  Bottom 0.203: v29.75,10 v25.5,10
N$37  (via drill 0.3)
  Top 0.203: U2.40 26.9,29.25 25,29.25 23.75,28 23.75,21.25 25,20 25,14 24.75,13.75 24.75,9.25 25,9 v25.5,9 | v29.75,9 30.5,8.25 68.25,8.25 69.25,9.25 69.25,31.25 71.25,33.25 S2.2A
  Bottom 0.203: v29.75,9 v25.5,9
N$38  (via drill 0.3)
  Top 0.203: U2.39 25,30 23.25,28.25 23.25,21.25 21.5,19.5 21.5,14.5 21.75,14.25 21.75,8.5 22.25,8 v25.5,8 | v29.75,8 30,7.75 74,7.75 75,8.75 S3.2B
  Bottom 0.203: v29.75,8 v25.5,8
N$39  (via drill 0.3)
  Top 0.203: U2.38 26.9,30.75 25,30.75 22.75,28.5 22.75,21.5 21,19.75 21,14.25 21.25,14 21.25,8.25 22.5,7 v25.5,7 | v29.75,7 30,7.25 88.25,7.25 89,8 S4.2B
  Bottom 0.203: v29.75,7 v25.5,7
N$40  (via drill 0.3)
  Top 0.203: U2.37 26.85,31.5 25,31.5 22.25,28.75 22.25,21.75 20.5,20 20.5,14 20.75,13.75 20.75,8 22.75,6 v25.5,6 | v29.75,6 30.5,6.75 70,6.75 S5.2A
  Bottom 0.203: v29.75,6 v25.5,6
N$41
  Top 0.203: R5.1 R3.1 R4.1 R6.1 R11.1
N$42
  Top 0.203: U2.36 26.8,32.25 25,32.25 21.75,29 21.75,27.75 19.5,25.5 BU2.SW2
N$43
  Top 0.203: U2.17 43,30 X1.2 44.79,30.04 45.75,31 46.98,31 C13.2
N$44  (via drill 0.3)
  Top 0.203: v98,71 98,69.53 R7.2
  Bottom 0.203: LCD1.10 72.81,74.06 73.25,74.5 90.5,74.5 94,71 v98,71
N$45
  Top 0.203: U4.1 59.62,32.15 R8.1 55.48,32.02 55,32.5 55,34.5 53.25,36.25 53.25,37.4 C18.-
N$46
  Top 0.203: U4.8 62.59,41 | 62.59,41 C19.1 | L3.1 62.59,41
N$47
  Top 0.203: U4.2 63.87,33.63 63.5,34 59.52,34 R8.2 R9.1
N$48
  Top 0.406: L4.2 5.5,38 3.5,36 3.5,34 3.25,33.75 J1.P$2
N$49
  Top 0.203: C20.2 R10.1 R11.2 55,25 55.5,25.5 55.5,29.25 56.5,30.25 64.75,30.25 65.14,30.64 U4.3
ROT1  (via drill 0.3)
  Top 0.203: U2.28 32.75,34.75 v33,34.5 | BU2.Q2 19.5,11.75 17.25,14 17.25,24 21.25,28 21.25,29.5 v23.5,31.75
  Bottom 0.203: v33,34.5 30.25,31.75 v23.5,31.75
ROT2  (via drill 0.3)
  Top 0.203: U2.29 31.95,34.7 v31.75,34.5 | v24,32.5 23.25,32.5 20.75,30 20.75,28.25 16.5,24 16.5,14 14.5,12 BU2.Q1
  Bottom 0.203: v31.75,34.5 29.5,32.25 24.25,32.25 v24,32.5
SCK  (via drill 0.3)
  Top 0.203: U2.9 35.15,22.1 35.5,21.75 35.5,20.5 38,18 38,15.77 CN2.5 38.07,9.75 v38,9.75 | v78,47.75 78,36.5 83.25,31.25 91,31.25 92.25,30 92.25,3.25 89.75,0.75 38.5,0.75 38,1.25 v38,5.5
  Bottom 0.203: LCD1.5 69.81,64.69 78,55 v78,47.75 | v38,9.75 v38,5.5
SD_CS  (via drill 0.3)
  Top 0.203: U2.8 34.35,22.85 v34.25,22.75 | v37.5,22.25 37.5,21.5 41.25,17.75 41.25,15.82 CN2.2
  Bottom 0.203: v34.25,22.75 37,22.75 v37.5,22.25
VUSB
  Top 0.178: 4.25,14.3 CN3.P1
  Top 0.203: U2.7 33.55,23.55 33.5,23.5
  Top 0.305: 33.5,19.5 33.5,24.15 U2.7 | 3.25,9.75 2.25,10.75 2.25,14 2.55,14.3 4.25,14.3
  Top 0.406: 33.5,19.5 33,19 28.75,19 28.25,18.5 28.25,3.75 26.5,2 16,2 10.5,7.5 5.25,7.5 3.25,9.5 3.25,9.75 | J1.P$1 2,31.25 2.5,30.75 2.5,29.41 U5.3 2.44,17.81 4.5,15.75 4.5,14.45 CN3.P1

### Text on the board
tPlace: 0 | 1 | 2 | 3 | 4 | 5 | 6 | 7 | BAT POW | USB POW | SmallRoomLabs.com
bPlace: Rev1 | S M A L L R O O M L A B S . C O M
tStop: BEEPOO